# EasyEDA schematic SCH_OMRA-TI-DRV8874-Module_2025-11-18.json
TITLE: TI DRV8874 Booster Driver; REV: 1.0; Date: 2025-11-17; Sheet: 1/1; Drawn By: Lance Bradley; Company: OMRA
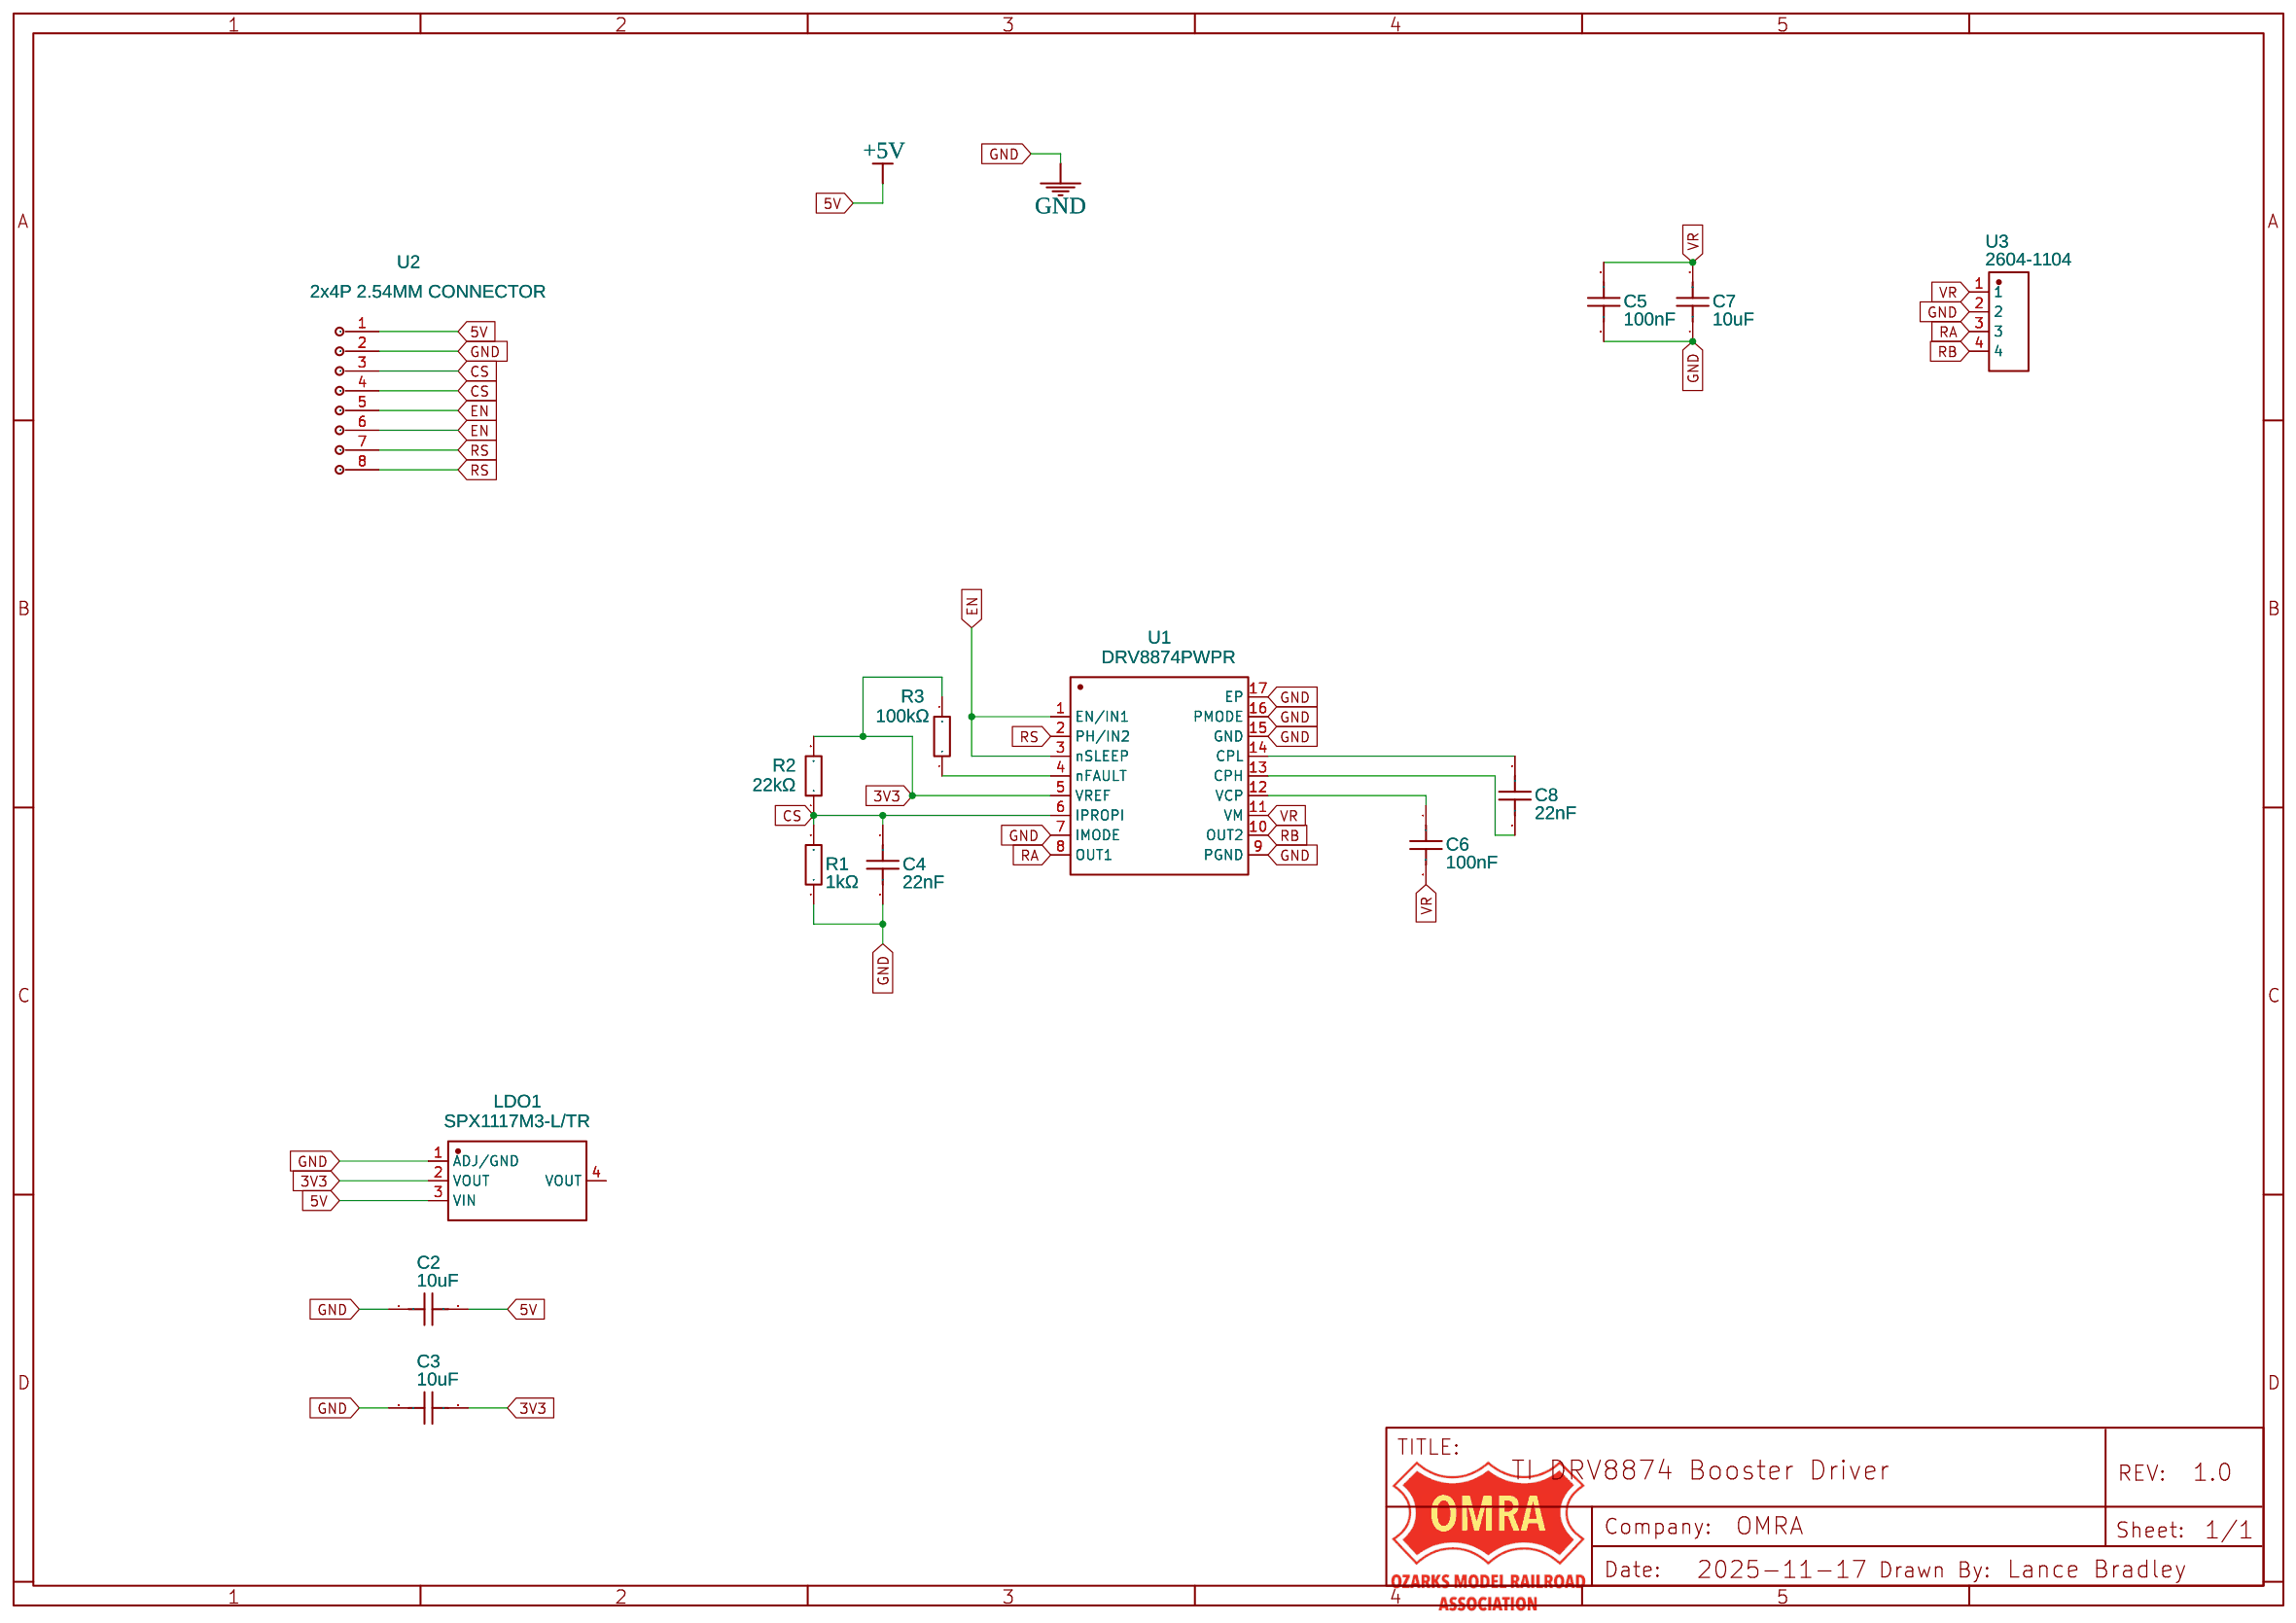
[diagram p0: schematic sheet]

## Parts
C2  10uF  [C1210]
C3  10uF  [C1210]
C4  22nF  [C0402]
C5  100nF  [C0402]
C6  100nF  [C0402]
C7  10uF  [C1210]
C8  22nF  [C0402]
LDO1  SPX1117M3-L/TR  [SOT-223-4_L6.5-W3.5-P2.30-LS7.0-BR]
R1  1kΩ  [RES-SMD_L3.5-W1.5]
R2  22kΩ  [RES-SMD_L3.5-W1.5]
R3  100kΩ  [RES-SMD_L3.5-W1.5]
U1  DRV8874PWPR  [HTSSOP-16_L5.0-W4.4-P0.65-LS6.4-BL-EP]
U2  2x4P 2.54MM CONNECTOR  [2X4 HEADER]
U3  2604-1104  [CONN-TH_2604-1104]

## Library data of the parts
C2 C3 C7 = CGA6P1X8R1E106K250AD: Contributor: lcsc; Supplier: LCSC; Supplier Part: C3835604; Manufacturer: TDK
C4-C6 C8 = CL05B104KP5VPNC: Supplier: LCSC; Supplier Part: C16193311; Manufacturer: SAMSUNG(三星); Contributor: lcsc; JLCPCB Part Class: Extended Part
LDO1 = SPX1117M3-L/TR: Supplier: LCSC; Manufacturer: MaxLinear(迈凌); Supplier Part: C67402; JLCPCB Part Class: Extended Part
R1-R3 = MELF-MFR02041/4WS1KΩFT50: Contributor: LCSC; JLCPCB Part Class: Extended Part; Supplier: LCSC; Supplier Part: C265216; Manufacturer: Thunder Component(帝谷)
U1 = DRV8874PWPR: Contributor: mtz8302; Supplier: LCSC; Supplier Part: C1855818; Manufacturer: TI(德州仪器); JLCPCB Part Class: Extended Part
U2 = 2x4P 2.54MM CONNECTOR: Contributor: Philip Allen
U3 = 2604-1104: Supplier: LCSC; Supplier Part: C3309598; Manufacturer: WAGO(万可); JLCPCB Part Class: Extended Part; Contributor: lcsc

## Nets
3V3: C3.2 LDO1.2(VOUT) R2.2 R3.2 U1.5(VREF)
+5V: C2.2 LDO1.3(VIN) U2.1
GND: C2.1 C3.1 C4.2 C5.2 C7.1 LDO1.1(ADJ/GND) R1.1 U1.7(IMODE) U1.9(PGND) U1.15(GND) U1.16(PMODE) U1.17(EP) U2.2(1) U3.2
CS: C4.1 R1.2 R2.1 U1.6(IPROPI) U2.3(1) U2.4(1)
EN: U1.1(EN/IN1) U1.3(nSLEEP) U2.5(1) U2.6(1)
RA: U1.8(OUT1) U3.3
RB: U1.10(OUT2) U3.4
RS: U1.2(PH/IN2) U2.7(1) U2.8(1)
VR: C5.1 C6.2 C7.2 U1.11(VM) U3.1
Net-(C6-1): C6.1 U1.12(VCP)
Net-(C8-1): C8.1 U1.14(CPL)
Net-(C8-2): C8.2 U1.13(CPH)
Net-(R3-1): R3.1 U1.4(nFAULT)

Not connected (* = marked no-connect by the designer): LDO1 4(VOUT)
